# EAGLE design right_revision0_6 (EAGLE 7.2.0)
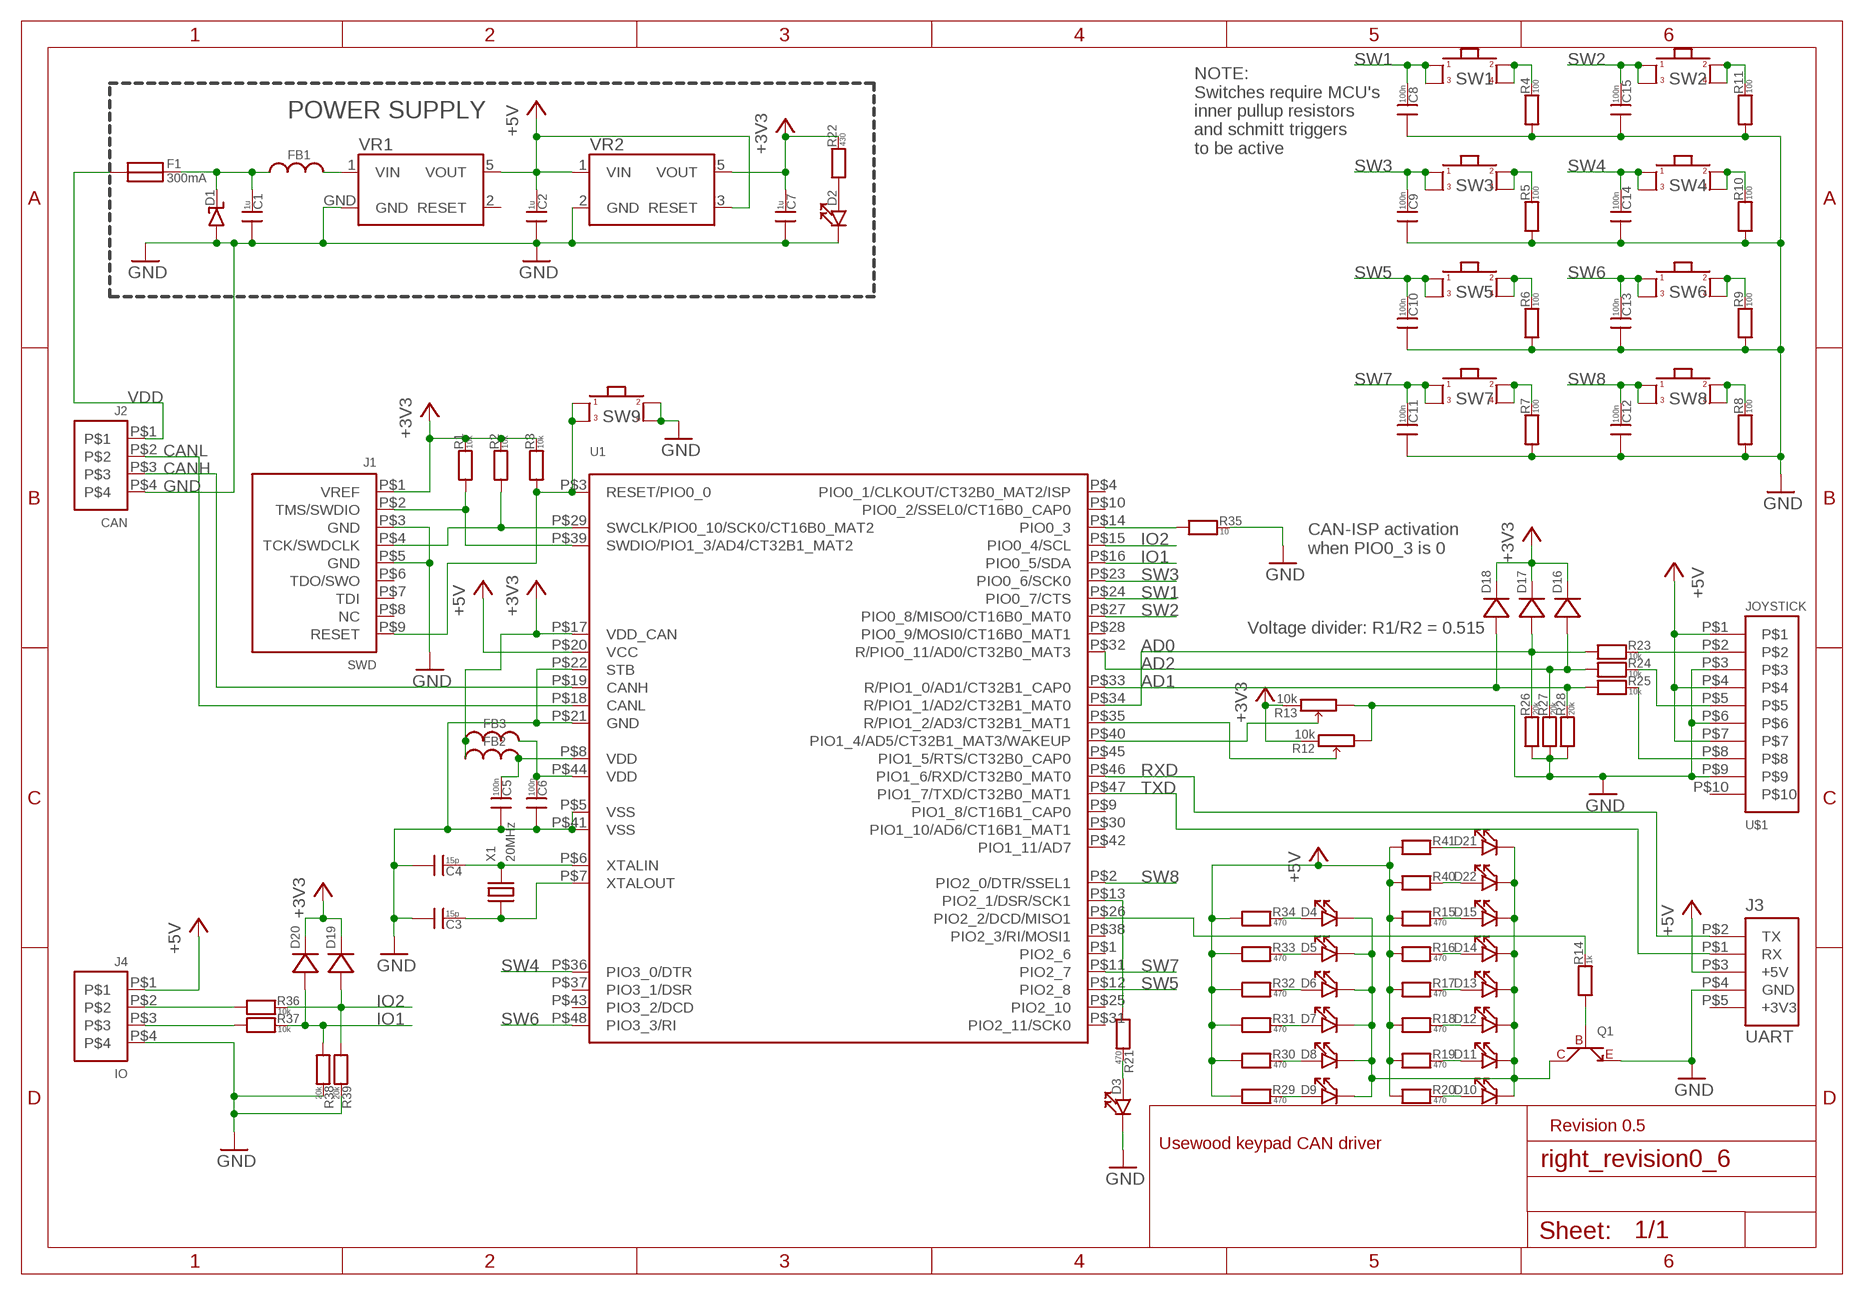
[diagram p0: schematic, sheet 1]

## Parts
C1  1u  CAP0603  [0603]
C2  1u  CAP0603  [0603]
C3  15p  CAP0603  [0603]
C4  15p  CAP0603  [0603]
C5  100n  CAP0603  [0603]
C6  100n  CAP0603  [0603]
C7  1u  CAP0603  [0603]
C8  100n  CAP0603  [0603]
C9  100n  CAP0603  [0603]
C10  100n  CAP0603  [0603]
C11  100n  CAP0603  [0603]
C12  100n  CAP0603  [0603]
C13  100n  CAP0603  [0603]
C14  100n  CAP0603  [0603]
C15  100n  CAP0603  [0603]
D1  DIODE_TVSDO-214AA  [DO-214AB]
D2  LED0603  [0603]
D3  LED0603  [0603]
D4  LED0603  [0603]
D5  LED0603  [0603]
D6  LED0603  [0603]
D7  LED0603  [0603]
D8  LED0603  [0603]
D9  LED0603  [0603]
D10  LED0603  [0603]
D11  LED0603  [0603]
D12  LED0603  [0603]
D13  LED0603  [0603]
D14  LED0603  [0603]
D15  LED0603  [0603]
D16  DIODEDO219AB  [DO219AB]
D17  DIODEDO219AB  [DO219AB]
D18  DIODEDO219AB  [DO219AB]
D19  DIODEDO219AB  [DO219AB]
D20  DIODEDO219AB  [DO219AB]
D21  LED0603  [0603]
D22  LED0603  [0603]
F1  300mA  FUSE100MA  [FUSE_100MA]
FB1  FERRITE0603  [0603]
FB2  FERRITE0603  [0603]
FB3  FERRITE0603  [0603]
J1  SWD  ARM_JTAG/SWD_HEADER_10_PINSMD  [ARM_10_PIN_JTAG/SWD_CONNECTOR]
J2  CAN  MOLEX_MICRO-FIT_4WAYTH  [MOLEX_MICRO-FIT_4WAY]
J3  UART  HEADER_USARTTH  [HEADER5_1]
J4  IO  MOLEX_MICRO-FIT_4WAYTH  [MOLEX_MICRO-FIT_4WAY]
Q1  NPN_TRANSISTORSOT323  [SOT323]
R1  10k  RES0603  [0603]
R2  10k  RES0603  [0603]
R3  10k  RES0603  [0603]
R4  100  RES0603  [0603]
R5  100  RES0603  [0603]
R6  100  RES0603  [0603]
R7  100  RES0603  [0603]
R8  100  RES0603  [0603]
R9  100  RES0603  [0603]
R10  100  RES0603  [0603]
R11  100  RES0603  [0603]
R12  10k  RES_POTRK09K1130C94  [RES_POT_RK09K1130C94]
R13  10k  RES_POTRK09K1130C94  [RES_POT_RK09K1130C94]
R14  1k  RES0603  [0603]
R15  470  RES0603  [0603]
R16  470  RES0603  [0603]
R17  470  RES0603  [0603]
R18  470  RES0603  [0603]
R19  470  RES0603  [0603]
R20  470  RES0603  [0603]
R21  470  RES0603  [0603]
R22  430  RES0603  [0603]
R23  10k  RES0603  [0603]
R24  10k  RES0603  [0603]
R25  10k  RES0603  [0603]
R26  20k  RES0603  [0603]
R27  20k  RES0603  [0603]
R28  20k  RES0603  [0603]
R29  470  RES0603  [0603]
R30  470  RES0603  [0603]
R31  470  RES0603  [0603]
R32  470  RES0603  [0603]
R33  470  RES0603  [0603]
R34  470  RES0603  [0603]
R35  10  RES0603  [0603]
R36  10k  RES0603  [0603]
R37  10k  RES0603  [0603]
R38  20k  RES0603  [0603]
R39  20k  RES0603  [0603]
R40  RES0603  [0603]
R41  RES0603  [0603]
SW1  SWITCH12X12MM_CENTER_HOLE  [SWITCH_12X12MM_CENTER_HOLE]
SW2  SWITCH12X12MM_CENTER_HOLE  [SWITCH_12X12MM_CENTER_HOLE]
SW3  SWITCH12X12MM_CENTER_HOLE  [SWITCH_12X12MM_CENTER_HOLE]
SW4  SWITCH12X12MM_CENTER_HOLE  [SWITCH_12X12MM_CENTER_HOLE]
SW5  SWITCH12X12MM_CENTER_HOLE  [SWITCH_12X12MM_CENTER_HOLE]
SW6  SWITCH12X12MM_CENTER_HOLE  [SWITCH_12X12MM_CENTER_HOLE]
SW7  SWITCH12X12MM_CENTER_HOLE  [SWITCH_12X12MM_CENTER_HOLE]
SW8  SWITCH12X12MM_CENTER_HOLE  [SWITCH_12X12MM_CENTER_HOLE]
SW9  SWITCHREGULAR  [SWITCH_REGULAR]
U1  LPC11C22QFP48  [QFP48]
U$1  JOYSTICK  MOLEX_MICRO-FIT_10WAYTH  [MOLEX-MICRO-FIT_10WAY]
VR1  NCV8675175AA  [175AA]
VR2  LP2985SOP5  [SOP5]
X1  20MHz  XTALSMD_5X3.2  [XTAL_SMD_5X3.2]

## Nets
+3V3: C7.1 D16.P$2(N) D17.P$2(N) D18.P$2(N) D19.P$2(N) D20.P$2(N) FB2.0 FB3.0 J1.P$1(VREF) R1.1 R2.1 R3.1 R12.P$3 R13.P$3 R22.1 U1.P$17(VDD_CAN) VR2.5(VOUT)
+5V: C2.1 J3.P$3(+5V) J4.P$1 R15.0 R16.0 R17.0 R18.0 R19.0 R20.0 R29.0 R30.0 R31.0 R32.0 R33.0 R34.0 R40.0 R41.0 U1.P$20(VCC) U$1.P$1 U$1.P$4 U$1.P$7 VR1.5(VOUT) VR2.1(VIN) VR2.3(RESET)
AD0: D17.P$1(P) R23.0 R26.1 U1.P$34(R/PIO1_1/AD2/CT32B1_MAT0)
AD1: D18.P$1(P) R25.0 R28.1 U1.P$33(R/PIO1_0/AD1/CT32B1_CAP0)
AD2: D16.P$1(P) R24.0 R27.1 U1.P$32(R/PIO0_11/AD0/CT32B0_MAT3)
CAN_ISP: R35.0 U1.P$14(PIO0_3)
CANH: J2.P$3 U1.P$19(CANH)
CANL: J2.P$2 U1.P$18(CANL)
GND: C1.0 C2.0 C3.0 C4.0 C5.0 C6.0 C7.0 C8.0 C9.0 C10.0 C11.0 C12.0 C13.0 C14.0 C15.0 D1.P$1(P) D2.1 D3.1 J1.P$3(GND) J1.P$5(GND) J2.P$4 J3.P$4(GND) J4.P$4 Q1.R(E) R4.0 R5.0 R6.0 R7.0 R8.0 R9.0 R10.0 R11.0 R12.P$1 R13.P$1 R26.0 R27.0 R28.0 R35.1 R38.1 R39.1 SW9.P$3 SW9.P$4 U1.P$5(VSS) U1.P$21(GND) U1.P$22(STB) U1.P$41(VSS) U$1.P$3 U$1.P$6 U$1.P$9 VR1.GND VR2.2(GND)
IO1: D20.P$1(P) R37.1 R38.0 U1.P$16(PIO0_5/SDA)
IO2: D19.P$1(P) R36.1 R39.0 U1.P$15(PIO0_4/SCL)
LED3: D3.0 R21.1
LED4: D4.0 R34.1
LED5: D5.0 R33.1
LED6: D6.0 R32.1
LED7: D7.0 R31.1
LED8: D8.0 R30.1
LED9: D9.0 R29.1
N$1: C1.1 D1.P$2(N) F1.P$2 FB1.0
N$2: C6.1 FB3.1 U1.P$44(VDD)
N$3: D2.0 R22.0
N$4: FB1.1 VR1.1(VIN)
N$5: R14.1 U1.P$26(PIO2_2/DCD/MISO1)
N$6: R21.0 U1.P$13(PIO2_1/DSR/SCK1)
N$11: R13.P$2 U1.P$40(PIO1_4/AD5/CT32B1_MAT3/WAKEUP)
N$12: R4.1 SW1.P$3 SW1.P$4
N$13: R5.1 SW3.P$3 SW3.P$4
N$14: R6.1 SW5.P$3 SW5.P$4
N$15: R11.1 SW2.P$3 SW2.P$4
N$16: R9.1 SW6.P$3 SW6.P$4
N$17: R10.1 SW4.P$3 SW4.P$4
N$18: R8.1 SW8.P$3 SW8.P$4
N$19: R7.1 SW7.P$3 SW7.P$4
N$20: D15.0 R15.1
N$21: D14.0 R16.1
N$22: D13.0 R17.1
N$23: D12.0 R18.1
N$24: D11.0 R19.1
N$25: D10.0 R20.1
N$26: C5.1 FB2.1 U1.P$8(VDD)
N$27: J4.P$2 R36.0
N$28: J4.P$3 R37.0
N$29: D21.0 R41.1
N$30: D22.0 R40.1
N$31: D4.1 D5.1 D6.1 D7.1 D8.1 D9.1 D10.1 D11.1 D12.1 D13.1 D14.1 D15.1 D21.1 D22.1 Q1.M(C)
PIO1_2: R12.P$2 U1.P$35(R/PIO1_2/AD3/CT32B1_MAT1)
Q1: Q1.L(B) R14.0
RESET: J1.P$9(RESET) R3.0 SW9.P$1 SW9.P$2 U1.P$3(RESET/PIO0_0)
RXD: J3.P$2(TX) U1.P$46(PIO1_6/RXD/CT32B0_MAT0)
SW1: C8.1 SW1.P$1 SW1.P$2 U1.P$24(PIO0_7/CTS)
SW2: C15.1 SW2.P$1 SW2.P$2 U1.P$27(PIO0_8/MISO0/CT16B0_MAT0)
SW3: C9.1 SW3.P$1 SW3.P$2 U1.P$23(PIO0_6/SCK0)
SW4: C14.1 SW4.P$1 SW4.P$2 U1.P$36(PIO3_0/DTR)
SW5: C10.1 SW5.P$1 SW5.P$2 U1.P$12(PIO2_8)
SW6: C13.1 SW6.P$1 SW6.P$2 U1.P$48(PIO3_3/RI)
SW7: C11.1 SW7.P$1 SW7.P$2 U1.P$11(PIO2_7)
SW8: C12.1 SW8.P$1 SW8.P$2 U1.P$2(PIO2_0/DTR/SSEL1)
SWDCLK: J1.P$4(TCK/SWDCLK) R2.0 U1.P$29(SWCLK/PIO0_10/SCK0/CT16B0_MAT2)
SWDIO: J1.P$2(TMS/SWDIO) R1.0 U1.P$39(SWDIO/PIO1_3/AD4/CT32B1_MAT2)
TXD: J3.P$1(RX) U1.P$47(PIO1_7/TXD/CT32B0_MAT1)
VDD: F1.P$1 J2.P$1
XJOY: R23.1 U$1.P$2
XTALIN: C4.1 U1.P$6(XTALIN) X1.P$2
XTALOUT: C3.1 U1.P$7(XTALOUT) X1.P$1
YJOY: R24.1 U$1.P$5
ZJOY: R25.1 U$1.P$8
Unconnected: J1.P$6(TDO/SWO) J1.P$7(TDI) J1.P$8(NC) J3.P$5(+3V3) U1.P$1(PIO2_6) U1.P$4(PIO0_1/CLKOUT/CT32B0_MAT2/ISP) U1.P$9(PIO1_8/CT16B1_CAP0) U1.P$10(PIO0_2/SSEL0/CT16B0_CAP0) U1.P$25(PIO2_10) U1.P$28(PIO0_9/MOSI0/CT16B0_MAT1) U1.P$30(PIO1_10/AD6/CT16B1_MAT1) U1.P$31(PIO2_11/SCK0) U1.P$37(PIO3_1/DSR) U1.P$38(PIO2_3/RI/MOSI1) U1.P$42(PIO1_11/AD7) U1.P$43(PIO3_2/DCD) U1.P$45(PIO1_5/RTS/CT32B0_CAP0) U$1.P$10 VR1.2(RESET)

## Notes on the sheet
- POWER SUPPLY
- NOTE:
  Switches require MCU's
  inner pullup resistors
  and schmitt triggers
  to be active
- CAN-ISP activation 
  when PIO0_3 is 0
- Voltage divider: R1/R2 = 0.515
- Revision 0.5
- Usewood keypad CAN driver

## Library data of the parts
C1-C15 = arm:CAP
D1 = arm:DIODE_TVS
D2-D15 D21 D22 = arm:LED
D16-D20 = usevolt:DIODE
F1 = arm:FUSE
FB1-FB3 = arm:FERRITE
J1 = arm:ARM_JTAG/SWD_HEADER_10_PIN: ARM Olimex Debugger 10 pin header, 0.05 inch
J2 J4 = arm:MOLEX_MICRO-FIT_4WAY: MOLEX 43045-0401 HEADER, RIGHT ANGLE, DUAL ROW, 4 WAY, 1704306
J3 = arm:HEADER_USART: USB to USART module header
Q1 = usevolt:NPN_TRANSISTOR: http://www.farnell.com/datasheets/1697409.pdf 9294511
R1-R11 R14-R41 = arm:RES
R12 R13 = usevolt:RES_POT
SW1-SW9 = arm:SWITCH
U1 = arm:LPC11C22: NXP MCU, 32BIT, CORTEX-M0, 50MHZ, LQFP-48, 2314753
U$1 = usevolt:MOLEX_MICRO-FIT_10WAY: MOLEX HEADER, MICRO-FIT, R/A, DUAL ROW, 10 WAY, 1012255
VR1 = arm:NCV8675: ON SEMICONDUCTOR NCV8675DT50RKG LDO, 350MA, 5V, 5DPAK, 1885151
VR2 = arm:LP2985: TEXAS INSTRUMENTS LP2985IM5-3.3 V REG LDO +3.3V, SMD, 2985, SOT235
X1 = arm:XTAL

## Board
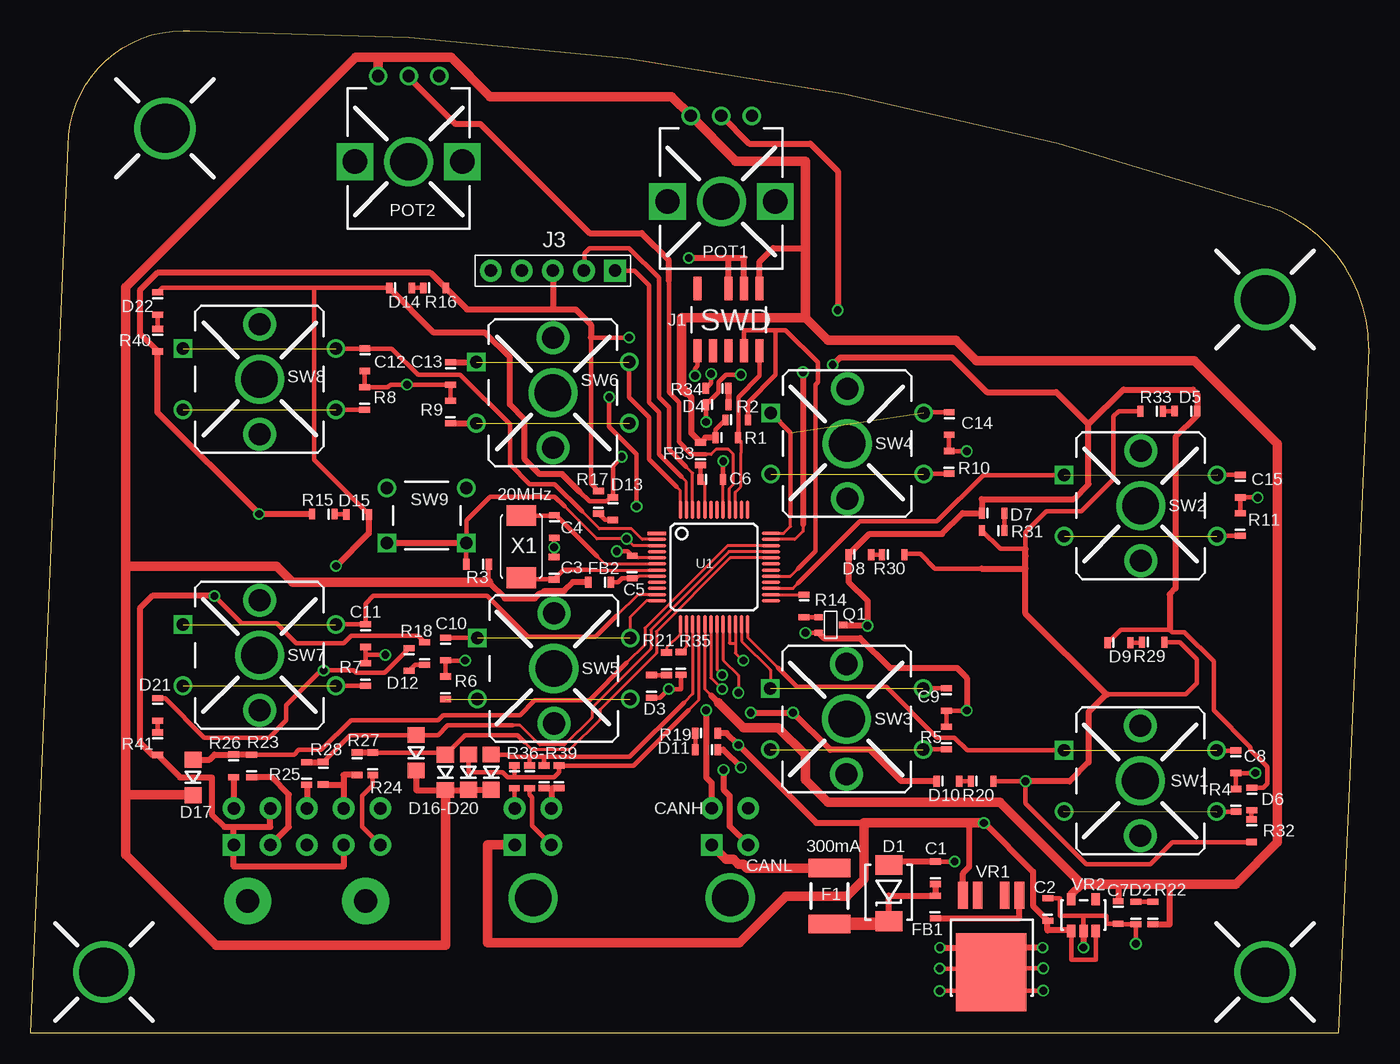
[diagram p1: board, top side]
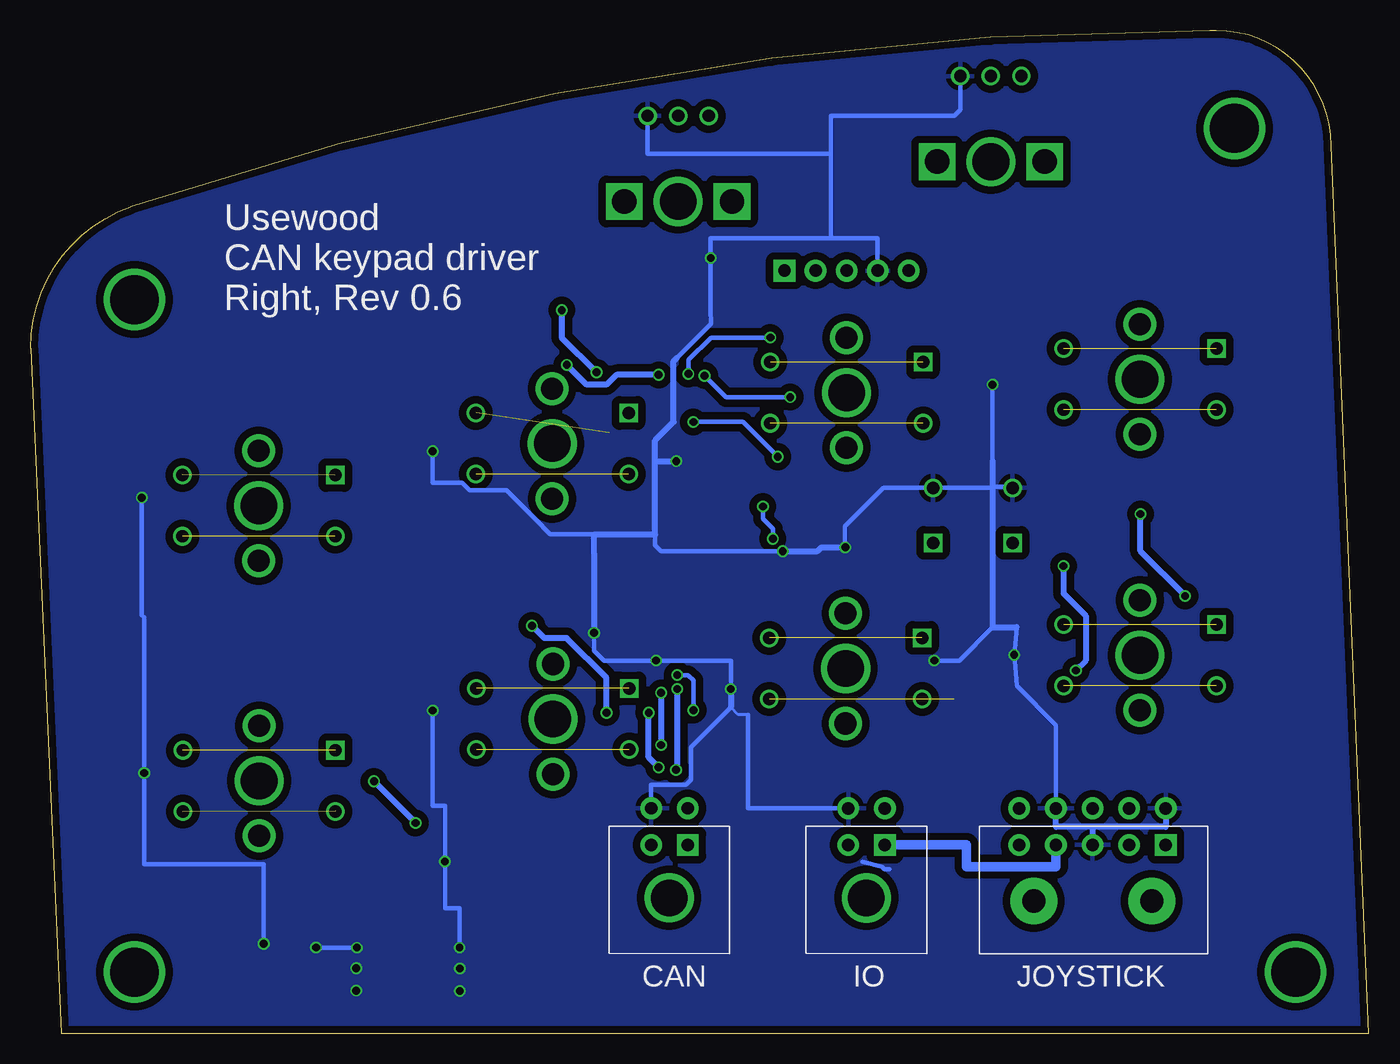
[diagram p2: board, bottom side, seen from below]

Size 109.5 x 82 mm. Coordinates in mm from the lower left corner, seen from the top.
Outline: 0,0 3.1,72.6 arc-90 12.5,82 13,82 arc-19 101.3,67.6 arc-71 109.5,56 107,0 0,0
Copper layers (1*16): Top 0.035mm / dielectric 1.5mm / Bottom 0.035mm
Design rules "SeeedStudio_2layer_DRU_no_angle_20140221 *": minimum track width 6mil, minimum drill 12mil, track to track 6mil, track to pad 6mil, pad to pad 6mil, via to via 6mil, smd to smd 0mil, copper to edge 10mil, drill to drill 10mil, minimum pad ring 10mil, minimum via ring 6mil, stop-mask expansion 2mil, vias tented up to drill 100mil, thermal gap 16mil

### Footprints (pad centres in the part's own frame; a part is rotated, then mirrored left to right if it is on the bottom)
0603 = smd 0.508 x 0.889: 0 -1.041,0; 1 0.8,0
DO-214AB = smd 1.62 x 2.18: P$1 0,0; P$2 4.6,0
DO219AB = smd 1.3 x 1.4: P$1 0,0; P$2 2.9,0
FUSE_100MA = smd 1.5 x 3.41: P$1 0,0; P$2 4.572,0
ARM_10_PIN_JTAG/SWD_CONNECTOR = smd 1.905 x 0.635: P$1 -1.27,0; P$2 3.81,0; P$3 -1.27,-1.27; P$4 3.81,-1.27; P$5 -1.27,-2.54; P$6 3.81,-2.54; P$7 3.81,-3.81; P$8 -1.27,-5.08; P$9 3.81,-5.08
MOLEX_MICRO-FIT_4WAY = drill 1.016 pad 1.778 square: P$1 1.27,2.032 | drill 1.016 pad 1.778: P$2 -1.727,2.032; P$3 1.27,5.029; P$4 -1.727,5.029 | drill 3: P$5 -0.25,-2.3
HEADER5_1 = drill 1.016 pad 1.778 square: P$1 0,0 | drill 1.016 pad 1.778: P$2 0,-2.54; P$3 0,-5.08; P$4 0,-7.62; P$5 0,-10.16
SOT323 = smd 0.5 x 0.7: L 0,0; M 0.63,2; R 1.27,0
RES_POT_RK09K1130C94 = drill 1: P$1 -2.5,0; P$2 0,0; P$3 2.5,0 | drill 2 square: P$4 -4.4,7; P$5 4.4,7 | drill 3 pad 2.9: P$6 0,7
SWITCH_12X12MM_CENTER_HOLE = drill 1.016 square: P$1 -3,4.75 | drill 1.016: P$2 9.5,4.75; P$3 -3,-0.25; P$4 9.5,-0.25 | drill 3 pad 2.9: P$5 3.25,2.25 | drill 1.8 pad 1.7: P$10 3.25,6.75; P$11 3.25,-2.25
SWITCH_REGULAR = drill 1.016 square: P$1 0,0; P$2 6.5,0 | drill 1.016: P$3 6.5,4.5; P$4 0,4.5
QFP48 = smd 1.5 x 0.28: P$1 0.2,0; P$2 0.2,-0.5; P$3 0.2,-1; P$4 0.2,-1.5; P$5 0.2,-2; P$6 0.2,-2.5; P$7 0.2,-3; P$8 0.2,-3.5; P$9 0.2,-4; P$10 0.2,-4.5; P$11 0.2,-5; P$12 0.2,-5.5; P$25 9.55,-5.5; P$26 9.55,-5; P$27 9.55,-4.5; P$28 9.55,-4; P$29 9.55,-3.5; P$30 9.55,-3; P$31 9.55,-2.5; P$32 9.55,-2; P$33 9.55,-1.5; P$34 9.55,-1; P$35 9.55,-0.5; P$36 9.55,0 | smd 0.28 x 1.5: P$13 2.125,-7.425; P$14 2.625,-7.425; P$15 3.125,-7.425; P$16 3.625,-7.425; P$17 4.125,-7.425; P$18 4.625,-7.425; P$19 5.125,-7.425; P$20 5.625,-7.425; P$21 6.125,-7.425; P$22 6.625,-7.425; P$23 7.125,-7.425; P$24 7.625,-7.425; P$37 7.625,1.925; P$38 7.125,1.925; P$39 6.625,1.925; P$40 6.125,1.925; P$41 5.625,1.925; P$42 5.125,1.925; P$43 4.625,1.925; P$44 4.125,1.925; P$45 3.625,1.925; P$46 3.125,1.925; P$47 2.625,1.925; P$48 2.125,1.925
MOLEX-MICRO-FIT_10WAY = drill 1.016 pad 1.778 square: P$1 0,-0.508 | drill 1.016 pad 1.778: P$2 -2.997,-0.508; P$3 -5.994,-0.508; P$4 -8.992,-0.508; P$5 -11.989,-0.508; P$6 0,2.489; P$7 -2.997,2.489; P$8 -5.994,2.489; P$9 -8.992,2.489; P$10 -11.989,2.489 | drill 1.905 pad 3.81: P$11 -10.795,-5.08; P$12 -1.143,-5.08
175AA = smd 2.2 x 0.8: 1 0,-2.2; 2 0,-1; 4 0,1.2; 5 0,2.4 | smd 6.4 x 5.8: GND -6.3,0.1
SOP5 = smd 0.7 x 1: 1 -1,0; 2 0,0; 3 1,0; 4 1,2.6; 5 -1,2.6
XTAL_SMD_5X3.2 = smd 1.7 x 2.4: P$1 -2.54,0; P$2 2.54,0

### Placement (x,y rotation side)
C1  74.03,13 270 top
C2  83.23,10 270 top
C3  42.84,37.91 270 top
C4  42.85,41.56 90 top
C5  49.23,38 270 top
C6  55.6,45.28 180 top
C7  88.98,10 90 top
C8  98.6,22.31 90 top
C9  74.93,27.41 90 top
C10  33.95,31.53 90 top
C11  27.4,32.63 90 top
C12  27.35,55.19 90 top
C13  34.35,54.07 90 top
C14  75.16,49.97 90 top
C15  98.97,44.85 90 top
D1  70.22,13.76 270 top
D2  90.43,9.7 270 top
D3  50.81,28.25 270 top
D4  56.07,51.4 180 top
D5  94.64,50.88 0 top
D6  99.92,19.27 90 top
D7  78.63,42.53 180 top
D8  67.74,39.14 180 top
D9  88.93,31.94 180 top
D10  74.93,20.61 180 top
D11  55.42,23.19 0 top
D12  30.96,30.67 90 top
D13  47.64,43.02 90 top
D14  30.15,60.95 180 top
D15  26.87,42.42 0 top
D16  33.94,22.79 270 top
D17  13.3,22.37 270 top
D18  31.55,24.39 270 top
D19  37.69,22.8 270 top
D20  35.83,22.8 270 top
D21  10.4,26.6 90 top
D22  10.4,59.8 90 top
F1  65.37,13.51 270 top
FB1  74.02,10.2 270 top
FB2  46.67,36.88 0 top
FB3  54.83,47.28 270 top
J1  59.65,59.63 270 top
J2  57,13.37 0 bottom
J3  47.82,62.36 270 top
J4  40.87,13.36 0 bottom
Q1  64.47,34.01 270 top
R1  56.84,48.7 180 top
R2  57.65,50.15 180 top
R3  36.69,38.37 0 top
R4  98.63,18.93 270 top
R5  74.94,24.03 270 top
R6  33.95,28.13 270 top
R7  27.41,29.23 270 top
R8  27.34,51.79 270 top
R9  34.36,50.69 270 top
R10  75.15,46.57 270 top
R11  98.97,41.49 270 top
R12  56.51,75.02 180 top
R13  30.93,78.28 180 top
R14  63.29,35.07 90 top
R15  24.07,42.46 0 top
R16  32.94,60.95 180 top
R17  46.46,43.3 270 top
R18  32.24,30.93 270 top
R19  55.18,24.53 180 top
R20  77.73,20.61 180 top
R21  52.04,30.09 270 top
R22  91.83,9.7 270 top
R23  18.09,21.74 270 top
R24  28,21.91 270 top
R25  22.59,21.13 270 top
R26  16.62,21.98 90 top
R27  26.72,22.16 90 top
R28  23.94,21.38 90 top
R29  91.73,31.98 180 top
R30  70.46,39.14 180 top
R31  78.87,41.11 0 top
R32  99.89,16.67 90 top
R33  91.84,50.87 0 top
R34  56.29,52.74 0 top
R35  53.21,30.13 270 top
R36  40.83,21.08 90 top
R37  39.58,21.08 90 top
R38  43.23,20.85 270 top
R39  42.02,20.85 270 top
R40  10.4,56.8 90 top
R41  10.4,23.8 90 top
SW1  87.55,18.39 0 top
SW2  87.57,40.89 0 top
SW3  63.52,23.44 0 top
SW4  63.57,45.97 0 top
SW5  39.56,27.58 0 top
SW6  39.48,50.13 0 top
SW7  15.48,28.66 0 top
SW8  15.48,51.24 0 top
SW9  29.16,40.1 0 top
U1  51.04,40.88 0 top
U$1  16.62,15.9 0 bottom
VR1  78.69,11.28 90 top
VR2  86.15,8.36 0 top
X1  40.14,39.8 90 top

### Tracks (layer width: path | path; a pad name or v marks a point on that pad's centre or on a via)
+3V3
  Top 0.254: U1.P$17 55.16,31.59 55.14,31.42 55.14,28.17 | 55.14,28.17 55.14,28.14 | 55.68,27.64 55.14,28.17
  Top 0.381: R3.1 37.49,37.03 37.49,36.88 | R2.1 56.04,49.35 R1.1
  Top 0.508: R22.1 93.2,8.9 93.2,12.2 | 88.98,12.2 C7.1 | 35.83,19.89 D16.P$2 31.55,19.89 D18.P$2 | D20.P$2 D19.P$2 | J1.P$1 59.65,63.1 60.76,64.21 63.4,64.21 | FB2.0 44.38,36.88 43.66,36.17 42.06,36.17 41.86,35.97 41.66,35.97 41.25,35.56 38.81,35.56 37.49,36.88 | R1.1 55.21,48.7 FB3.0 54.05,49.09 54.05,52.02 53.65,52.43 | 56.29,27.03 55.68,27.64
  Top 0.635: VR2.5 85.15,11.35 86,12.2
  Top 0.762: 7.8,19.51 7.8,14.6 15.2,7.2 33.94,7.2 D16.P$2 | 7.8,19.51 7.8,38.2 | 7.8,38.2 7.8,61.01 26.59,79.8 28.43,79.8 | 35.83,19.89 D20.P$2 | D17.P$2 13.26,19.51 7.8,19.51 | R13.P$3 28.43,79.8 | 28.43,79.8 34.4,79.8 37.59,76.61 52.43,76.61 R12.P$3 | R12.P$3 54.05,75.06 | 56.29,27.03 58.32,24.99 61.16,24.99 63.4,22.76 63.4,20.73 65.23,18.9 79.3,18.9 86,12.2 88.98,12.2 93.2,12.2 98.6,12.2 102,15.6 102,48.2 95.2,55 77.4,55 75.71,56.69 65.23,56.69 63.4,58.52 | 37.49,36.88 21.44,36.88 20.12,38.2 7.8,38.2 | 63.4,58.52 53.24,58.52 53.24,52.83 53.65,52.43 | 63.4,58.52 63.4,58.72 63.4,64.21 63.4,71.32 57.67,71.32 57.67,71.37 R12.P$3
+5V  (via drill 0.64)
  Top 0.254: U1.P$20 56.66,30.51 57.91,29.26 v57.91,27.84
  Top 0.381: VR2.1 85.15,6 87.15,6 VR2.3 | R32.0 93.43,15.63 91.6,13.8 86.4,13.8 81.4,18.8 v81.4,20.6 R20.0 | R29.0 94.02,31.98 95.4,30.6 95.4,28.6 94.5,27.7 88.1,27.7 | 71.48,39.14 71.5,39.17 | 77.8,38 74,38 72.8,39.2 71.53,39.2 71.5,39.17 | R31.0 79.34,39.6 81.4,39.6 | 33.97,60.95 34.05,60.87 34.05,60.88 R16.0 | 71.5,39.17 R30.0 | 90.8,50.9 R33.0 89.02,50.88 88.59,50.45 88.59,45.31 85.95,42.67 83.11,42.67 81.4,40.96 81.4,39.01 | v55.68,53.92 55.68,53.17 R34.0 | v48.97,56.9 45.85,56.9 45.85,44.95 R17.0 | R18.0 31.7,32.51 26.21,32.51 25.6,31.9 21.74,31.9 20.12,33.53 17.27,33.53 v15.04,35.76 | 9.96,22.76 R41.0 | 18.7,42.46 v18.69,42.47
  Top 0.508: VR2.1 85.15,8.4 83.2,8.4 83.2,9.2 C2.1 82.02,10.41 82.02,13.21 78.03,17.2 v78,17.2 | 81.4,38 81.4,39.01 81.4,39.6 | 34.05,60.87 35.71,59.2 42.67,59.2 | 42.67,59.2 44.6,59.2 45.85,57.95 45.85,56.9 | VR1.5 76.29,13.1 76.81,13.61 76.81,17.2 | 77.8,38 81.4,38 | 16.62,16.87 U$1.P$1 16.62,13.61 25.6,13.61 U$1.P$4 | 16.62,16.87 19.62,16.87 U$1.P$7 | R41.0 12.23,20.93 14.83,20.93 14.83,17.88 15.85,16.87 16.62,16.87 | 68.2,17.2 64.28,17.2 v57.91,23.57 56.95,24.53 R19.0 | J3.P$3 42.74,59.27 42.67,59.2 | 88,27.7 81.4,34.3 81.4,38 | 88,27.7 88.1,27.7 | 88,27.7 86.56,26.26 86.56,22.15 85.01,20.6 v81.4,20.6 | v15.04,35.76 9.96,35.76 8.94,34.75 8.94,23.77 9.96,22.76 | R15.0 18.7,42.46 | v18.69,42.47 10.4,50.76 R40.0 8.94,57.22 8.94,60.76 10.36,62.18 32.72,62.18 33.95,60.95 R16.0
  Top 0.762: v78,17.2 76.81,17.2 68.2,17.2 68.2,12.6 66.8,11.2 61.8,11.2 58,7.4 37.39,7.4 37.39,15.39 J4.P$1
  Bottom 0.381: v55.68,53.92 55.68,55.07 53.85,56.9 v48.97,56.9
  Bottom 0.508: v78,17.2 v81.4,20.6 | v57.91,27.84 v57.91,23.57 | v15.04,35.76 18.69,39.42 v18.69,42.47
  Bottom 0.762: J4.P$1 32.92,15.39 32.92,13.61 25.6,13.61 U$1.P$4
AD0
  Top 0.254: U1.P$34 57.02,39.88 50.27,33.12 50.27,31.77 48.77,30.28
  Top 0.381: 48.77,30.28 45.72,27.23 41.25,27.23 40.03,26.01 33.73,26.01 33.33,25.6 26.21,25.6 23.77,23.16 21.95,23.16 21.56,22.78 R23.0
  Top 0.508: R23.0 R26.1 15.06,22.79 14.65,22.37 D17.P$1
AD1
  Top 0.254: U1.P$33 57.13,39.38 50.75,32.99 50.75,31.45 45.92,26.62 45.92,25.81 43.69,23.57 41.66,23.57 40.03,25.2 39.42,25.2
  Top 0.381: R28.1 26.15,24.39 D18.P$1 33.33,24.39 34.14,25.2 39.42,25.2
  Top 0.508: R25.0 22.6,22.18 R28.1
AD2
  Top 0.254: U1.P$32 57.24,38.88 51.21,32.84 51.21,31.09 46.58,26.47 46.58,25.65 44.09,23.16 41.05,23.16 40.44,23.77
  Top 0.381: R24.0 33.94,22.95 D16.P$1 35.53,24.38 39.83,24.38 40.44,23.77
  Top 0.508: R24.0 R27.1
CAN_ISP
  Top 0.254: U1.P$14 53.66,31.62 R35.0
CANH  (via drill 0.64)
  Top 0.254: U1.P$19 56.16,29.71 v56.59,29.29
  Top 0.508: v55.27,26.42 55.27,20.93 55.73,20.47 J2.P$3
  Bottom 0.381: v56.59,29.29 55.7,29.29 55.27,28.85 v55.27,26.42
CANL  (via drill 0.64)
  Top 0.254: U1.P$18 55.66,29.07 v56.59,28.14
  Top 0.508: v56.69,21.54 56.69,19.91 57.2,19.41 57.2,16.92 J2.P$2
  Bottom 0.508: v56.59,28.14 56.59,21.64 v56.69,21.54
GND  (via drill 0.61, 0.64)
  Top 0.254: U1.P$5 49.72,38.88 49.58,39.01 C5.0 | U1.P$22 57.66,31.9 | 57.66,31.9 57.66,31.09 v58.32,30.48 | U1.P$21 57.16,31.9 57.66,31.9 | U1.P$41 56.65,42.82 C6.0
  Top 0.381: 86.15,9.6 88,9.6 88,8.96 C7.0 88.98,8.9 D2.1 v90.43,7.32 v90.42,7.32 | 86.15,9.6 VR2.2 | C2.0 84.2,11.04 84.2,9.6 86.15,9.6 | R4.0 98.6,19.99 C8.0 v100.2,21.27 v100.2,21.26 | R11.0 C15.0 100.4,43.81 v100.4,43.8 | C14.0 R10.0 v76.6,47.61 v76.6,47.6 | R5.0 74.94,26.36 C9.0 76.6,26.37 v76.6,26.4 | R9.0 C13.0 | C13.0 | C12.0 R8.0 29.23,52.83 29.44,53.04 v30.8,53.04 v30.8,53.03 C13.0 | R7.0 27.41,30.89 | 27.41,30.89 C11.0 | 75.6,14 v75.6,14.04 C1.0 | C3.0 v42.84,39.73 42.84,40.51 C4.0 | v82.86,5.31 78.92,5.31 VR1.GND | v82.86,3.48 80.09,3.48 VR1.GND | VR1.GND 78.59,4.88 | v74.37,3.45 77.06,3.45 VR1.GND | v74.37,5.28 78.29,5.28 VR1.GND | v63.4,32.74 64.44,32.74 Q1.R | C6.0 56.65,46.8 56.69,46.8 56.69,46.79 v56.67,46.79 | R35.1 53.21,28.14 v52.21,28.14 51.52,27.45 D3.1 | v47.95,39.42 48.85,39.42 C5.0 | R6.0 C10.0 33.96,30.48 v35.56,30.48 | v29.02,30.94 27.41,30.94 27.41,30.89
  Top 0.508: C1.0 70.22,14.04 D1.P$1 | 83.2,11.04 C2.0 | v82.8,7 80.2,7 80.2,4.57 78.59,4.57 78.59,4.88 78.59,5.2 | 78.59,5.2 78.59,5.4 78.4,5.4 78.4,7 v74.4,7 | 78.6,3.6 78.6,5.2 78.59,5.2 | VR2.2 v86.15,7 86.16,6.98 | R26.0 16.62,20.62 U$1.P$6 | R28.0 25.61,20.33 | 25.61,20.33 U$1.P$9 | R27.0 25.61,21.12 25.61,20.33 | J1.P$3 58.38,63.4 57.11,63.4 | 57.11,63.4 v53.85,63.4 | J1.P$5 57.11,63.4 | Q1.R 64.9,32.31 67.87,32.31 70.31,29.87 75.79,29.87 76.6,29.06 v76.6,26.4 | J4.P$4 42.67,18.46 42.67,20.05 | R39.1 42.67,20.05 | 42.67,20.05 R38.1
  Bottom 0.254: 50.82,26.05 51.6,26.05 52.21,26.66
  Bottom 0.381: 86.16,6.98 v86.16,7 v86.15,7 v82.8,7 | v74.4,7 74.4,10.2 75.6,10.2 v75.6,14.04 75.6,18.6 76.6,18.6 v76.6,26.4 | v100.2,21.27 100.2,34 100.4,34.2 v100.4,43.8 | v100.2,21.27 v100.2,21.26 | 53.86,65 44,65 | 44,65 44,71.93 | 44,71.93 44,75.02 33.92,75.02 33.43,75.51 R13.P$1 | 56.63,55.23 53.84,58.02 53.86,59.2 v53.86,63.4 53.86,65 | 53.87,65 53.86,65 | 28.82,33.2 v29.02,30.94 28.82,28.41 25.6,25.2 U$1.P$9 | 30.8,46.8 v30.8,53.04 | v76.6,47.6 76.6,45 74.2,45 73.6,44.4 70.56,44.4 68.2,42.04 67,40.8 63.39,40.8 | v63.4,32.74 63.39,33.14 63.39,31.29 62.59,30.48 v58.32,30.48 52.21,30.48 v52.21,28.14 | 63.39,39.2 63.4,39.2 | 56.63,46.79 v56.67,46.79 | v90.42,7.32 90.42,13.82 100.2,13.82 v100.2,21.27 | SW9.P$4 29.27,44.7 30.8,44.7 | 44,65 40.2,65 J3.P$4 | R12.P$1 59.01,71.93 44,71.93 | 52.21,26.66 55.47,23.4 55.47,20.73 55.88,20.32 58.73,20.32 J2.P$4 | v42.84,39.73 42.88,39.77 42.88,41.45 39.73,44.6 SW9.P$3 30.9,44.6 30.8,44.5 | 50.82,26.05 50.82,18.39 J4.P$4 | v47.95,39.42 57.91,39.42 58.4,39.91 58.4,40.8 | v35.56,30.48 33.52,30.48 30.8,33.2 | 39.22,13.41 39.62,13.41 39.83,13.61 41.45,14.02
  Bottom 0.508: 63.39,39.2 63.39,40.8 58.4,40.8 58.4,46.79 | 63.4,39.2 v63.4,32.74 | 30.8,46.8 30.8,44.7 30.8,44.5 30.8,33.2 28.82,33.2 | 58.4,46.79 v56.67,46.79 | 22.61,15.39 U$1.P$3 22.62,16.87 | U$1.P$6 16.62,16.87 22.62,16.87 | 22.62,16.87 25.61,16.87 U$1.P$9 | v53.85,63.4 v53.86,63.4 | v52.21,28.14 52.21,26.66 | v47.95,39.42 45.11,39.42 44.8,39.73 v42.84,39.73 | 58.4,46.79 58.4,48.48 56.9,49.99 56.9,54.96 56.63,55.23
  pour Bottom (isolate 0.61): 107,0 109.4,56.4 arc41 107.2,63.2 arc28 102,67.2 arc9 93.2,70.2 arc-1 76.2,74.6 arc5 59.4,78.2 arc6 31.4,81.4 arc3 14.6,82 arc1 12.2,82 arc15 10.8,81.8 arc5 8.4,81 arc27 5.8,79.2 arc39 3.2,72.8 0,0
IO1
  Top 0.254: U1.P$16 54.66,27.23 53.85,26.42
  Top 0.381: D20.P$1 35.83,21.34 38.61,21.34 39.01,20.93 39.62,20.93 | 53.85,26.42 49.32,21.89 R38.0 43.23,21.34 42.82,20.93 39.62,20.93 | R37.1 39.58,20.97 39.62,20.93
IO2
  Top 0.254: U1.P$15 54.16,27.75 53.44,27.03
  Top 0.381: 40.83,22.59 R36.1 | R39.0 42.02,22.59 | 42.02,22.59 40.83,22.59 | 53.44,27.03 49.01,22.59 42.02,22.59 | 40.83,22.59 39.18,22.59 39.01,22.76 37.73,22.76 D19.P$1
LED3
  Top 0.381: D3.0 52.03,29.29 R21.1
LED4
  Top 0.508: R34.1 57.09,51.42 D4.0
LED5
  Top 0.381: D5.0 92.64,50.88 | 92.64,50.88 92.64,50.9 | 92.64,50.88 R33.1
LED6
  Top 0.381: R32.1 99.89,18.2 D6.0
LED7
  Top 0.381: R31.1 D7.0
LED8
  Top 0.381: 69.64,39.14 D8.0 68.86,39.22 68.89,39.22
  Top 0.508: 69.64,39.14 R30.1
LED9
  Top 0.381: D9.0 90.89,31.94 R29.1
N$1
  Top 0.508: C1.1 74.02,12.2 FB1.0 70.22,11.24 D1.P$2
  Top 1.016: F1.P$2 70.22,8.94 D1.P$2
N$2
  Top 0.254: U1.P$44 55.16,44.92 C6.1
  Top 0.381: FB3.1 54.83,45.3 C6.1
N$3
  Top 0.381: R22.0 D2.0
N$4
  Top 0.508: FB1.1 80.89,9.4 VR1.1
N$5
  Top 0.254: U1.P$26 63.08,35.88 R14.1
N$6
  Top 0.254: U1.P$13 53.16,32.64 52.03,31.51 R21.0
N$7  (via drill 4)
  other vias: 6,5
N$8  (via drill 4)
  other vias: 101,5
N$9  (via drill 4)
  other vias: 101,60
N$10  (via drill 4)
  other vias: 11,74
N$11
  Top 0.254: U1.P$40 57.16,44.57 57.51,44.91 57.51,47.35 57.1,47.75 56.08,47.75 55.68,47.35 55.27,47.35
  Top 0.381: 55.27,47.35 54.05,47.35 53.03,48.36 53.03,51.61 52.22,52.43 52.22,61.57
  Top 0.508: 52.22,61.57 52.22,63.2 49.99,65.43 45.72,65.43 36.78,74.37 34.75,74.37 30.93,78.18 R13.P$2
N$12  (1 unrouted)
  Top 0.381: 98.61,18.11 R4.1 97.06,18.13 SW1.P$4
N$13  (1 unrouted)
  Top 0.381: R5.1 73.04,23.22 SW3.P$4
N$14  (2 unrouted)
N$15  (1 unrouted)
  Top 0.381: 98.95,40.67 R11.1 97.12,40.69 SW2.P$4
N$16  (1 unrouted)
  Top 0.381: R9.1
  Top 0.508: R9.1 SW6.P$3
N$17  (1 unrouted)
  Top 0.381: R10.1 73.11,45.77 SW4.P$4
N$18  (1 unrouted)
  Top 0.381: R8.1 SW8.P$4
N$19  (1 unrouted)
  Top 0.381: R7.1 24.99,28.43 SW7.P$4
N$20
  Top 0.381: D15.0 25.8,42.46 R15.1
N$21
  Top 0.381: 32.13,60.95 32.1,60.97 31.17,60.97 D14.0
  Top 0.508: R16.1 32.11,60.97 32.1,60.97
N$22
  Top 0.381: D13.0 46.98,41.98 R17.1
N$23
  Top 0.381: D12.0 31.45,30.13 R18.1
N$24
  Top 0.381: D11.0 54.38,24.32 R19.1
N$25
  Top 0.381: D10.0 R20.1
N$26
  Top 0.254: U1.P$8 49.77,37.38 49.58,37.19 49.24,37.19 C5.1
  Top 0.381: C5.1 48.38,37.2 48.06,36.88 FB2.1
N$27
  Top 0.381: R36.0 40.83,19.52 41.05,19.3 41.05,16.95 J4.P$2
N$28
  Top 0.381: R37.0 39.58,18.39 J4.P$3
N$29
  Top 0.381: R41.1 D21.0
N$30
  Top 0.381: R40.1 D22.0
N$31  (via drill 0.64)
  Top 0.381: D6.1 100.87,20.07 101.2,20.4 101.2,21.8 99.8,23.2 99.8,23.4 96.8,26.4 96.8,30.4 94.4,32.8 93.4,32.8 93.2,33 89.18,33 D9.1 | D22.1 10.77,60.97 23.2,60.97 | 23.2,60.97 29.26,60.97 29.33,60.97 | D15.1 23.2,46.9 23.2,60.97 | v55.27,49.99 D4.1 56.29,52.43 56.29,53.24 56.9,53.85 v58.12,53.85 | v48.36,47.14 47.64,46.42 D13.1 47.48,43.82 47.14,43.48 45.72,43.48 44.91,44.3 | D21.1 11.01,27.4 14.22,24.18 19.51,24.18 20.93,25.6 20.93,26.82 23.77,29.67 v23.98,29.67 26.42,29.67 26.62,29.46 28.95,29.46 D12.1
  Top 0.508: 44.91,44.3 43.48,45.72 41.66,45.72 40.44,46.94 40.44,50.19 39.22,51.41 39.22,55.27 37.19,57.3 32.99,57.3 D14.1 29.32,60.97 29.26,60.97 | D15.1 27.67,40.88 v24.99,38.2 | D10.1 71.23,20.61 68.68,23.16 65.43,23.16 v62.38,26.21 v58.93,26.21 | Q1.M 66.53,33.33 v68.48,33.33 68.48,35.36 66.94,36.9 D8.1 68.64,40.84 74.57,40.84 76.26,42.53 D7.1 77.83,43.69 | D11.1 56.66,23.2 v58.12,21.74 | 93.2,33 93.2,35.9 93.67,36.37 93.67,48.75 95.44,50.52 D5.1 95.44,52.29 95.1,52.63 89.41,52.63 86.56,49.78 | 77.83,43.69 | 77.83,43.69 85.34,43.69 86.56,44.91 86.56,49.78 | v65.63,54.66 66.24,55.27 75.39,55.27 78.23,52.43 83.92,52.43 86.56,49.78
  Bottom 0.381: v55.27,49.99 51.21,49.99 v48.36,47.14
  Bottom 0.508: v24.99,38.2 24.99,35.97 23.16,34.14 23.16,30.48 v23.98,29.67 | v62.38,26.21 62.38,29.06 65.63,32.31 67.46,32.31 v68.48,33.33 | v58.12,21.74 58.93,22.55 v58.93,26.21 | v58.12,53.85 61.57,53.85 62.38,53.03 64.01,53.03 v65.63,54.66
PIO1_2  (via drill 0.64)
  Top 0.254: 63.2,41.66 63.2,41.05 62.53,40.38 U1.P$35
  Top 0.508: v66.04,59.13 66.04,70.51 63.8,72.75 58.79,72.75 R12.P$2 | v63.2,54.05 63.2,41.66
  Bottom 0.508: v66.04,59.13 66.04,56.9 v63.2,54.05
Q1
  Top 0.381: R14.0 64.46,34.03 Q1.L
RESET  (via drill 0.64)
  Top 0.254: U1.P$3 49.33,39.88 v48.77,40.44 46.33,40.44 43.69,43.08
  Top 0.381: R3.0 35.65,40.09 SW9.P$2 | 43.69,43.08 42.88,43.89 37.59,43.89 35.66,41.96 SW9.P$2 | SW9.P$2 | v47.35,52.02 47.35,49.58 49.58,47.35 v49.58,43.08 | v54.36,53.77 54.36,54.36 54.57,54.57 J1.P$9
  Top 0.508: 35.65,40.09 29.18,40.09 SW9.P$1
  Bottom 0.381: v54.36,53.77 52.6,52.02 v47.35,52.02 | v49.58,43.08 49.58,42.06 48.77,41.25 v48.77,40.44
RXD
  Top 0.254: U1.P$46 54.16,45.81 53.65,46.33
  Top 0.381: 53.65,46.33 52.22,47.75 52.22,51.21 51.41,52.02 51.41,61.77 48.97,64.21 45.72,64.21 45.31,63.8 45.31,62.4 J3.P$2
SW1  (1 unrouted)
  Top 0.254: U1.P$24 58.66,32.37 61.16,29.87
  Top 0.381: C8.1 97.07,23.11 SW1.P$2 | 61.16,29.87 62.71,28.32 70.03,28.32 74.17,24.18 75.59,24.18 76.63,23.14 SW1.P$1
SW2  (1 unrouted)
  Top 0.254: U1.P$27 62.39,36.38 62.79,36.78
  Top 0.381: 98.95,45.67 C15.1 97.09,45.65 SW2.P$2 | 62.79,36.78 67.87,41.86 74.17,41.86 77.95,45.64 SW2.P$1
SW3  (1 unrouted)
  Top 0.254: U1.P$23 58.16,32.06 60.52,29.7 SW3.P$1
  Top 0.381: C9.1 73.04,28.21 SW3.P$2
SW4  (1 unrouted)
  Top 0.254: U1.P$36 61.6,40.88 62.18,41.45 62.18,42.27
  Top 0.381: C14.1 | 62.18,42.27 62.18,49.11 SW4.P$1 | C14.1 73.12,50.77 SW4.P$2
SW5  (1 unrouted)
  Top 0.254: U1.P$12 50.41,35.38 49.06,34.02 SW5.P$2
  Top 0.381: C10.1 36.48,32.33 36.49,32.33 SW5.P$1
SW6  (1 unrouted)
  Top 0.254: U1.P$48 53.16,44.37 52.83,44.7
  Top 0.381: 52.83,44.7 50.6,46.94 50.6,50.39 48.97,52.02 48.97,54.87 SW6.P$2
  Top 0.508: C13.1 34.36,54.88 SW6.P$1
SW7  (1 unrouted)
  Top 0.254: U1.P$11 49.7,35.88 47.95,34.14
  Top 0.381: SW7.P$2 25,33.43 C11.1 27.4,35.12 28.04,35.76 37.36,35.76 40.72,32.41 46.23,32.41 47.95,34.14
SW8  (1 unrouted)
  Top 0.254: U1.P$2 50.05,40.38 49.17,41.25 46.53,41.25 45.11,42.67
  Top 0.381: SW8.P$2 C12.1 29.55,55.99 31.7,53.85 35.15,53.85 39.22,49.78 39.22,46.53 40.84,44.91 42.88,44.91 45.11,42.67
SWDCLK
  Top 0.254: U1.P$29 62.17,37.38 62.79,38
  Top 0.381: J1.P$4 58.38,57.51 60.96,57.51 | 60.96,57.51 60.96,53.85 58.69,51.58 R2.0 | 62.79,38 64.21,39.42 64.21,53.03 64.41,53.24 64.41,54.86 61.77,57.51 60.96,57.51
SWDIO
  Top 0.254: U1.P$39 57.66,44.25 58.12,44.7 58.12,47.14 58.12,47.46 58.12,48.47 R1.0
  Top 0.381: J1.P$2 59.65,53.76 57.91,52.02 57.91,49.17 57.89,49.15 R1.0
TXD
  Top 0.254: U1.P$47 53.66,45.09 53.24,45.52
  Top 0.381: 53.24,45.52 51.41,47.35 51.41,50.8 50.6,51.61 50.6,61.16 49.4,62.36 J3.P$1
VDD
  Top 0.762: J2.P$1 56.9,14.22 57.51,14.22 57.91,13.82 58.32,13.82 58.63,13.51 F1.P$1
XJOY
  Top 0.508: U$1.P$2 19.66,15.39 21.13,16.87 21.13,19.51 19.71,20.93 R23.1
XTALIN
  Top 0.254: 46.33,39.01 46.97,38.38 U1.P$6
  Top 0.381: X1.P$2 42.82,42.34 C4.1 42.95,42.27 43.08,42.27 46.33,39.01
XTALOUT
  Top 0.254: 45.57,37.9 45.64,37.88 U1.P$7
  Top 0.381: X1.P$1 40.29,37.11 C3.1 43.63,37.9 45.57,37.9
YJOY
  Top 0.381: R24.1 28,20.28 27.13,19.41 27.13,16.88 U$1.P$5
ZJOY
  Top 0.508: R25.1 22.62,20.3 U$1.P$8

### Text on the board
tPlace: POT2 | POT1 | SWD | R36-R39 | D16-D20 | CANH | CANL
bPlace: Usewood / CAN keypad driver / Right, Rev 0.6 | JOYSTICK | IO | CAN